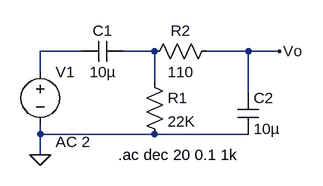
[diagram p0: schematic BPF.asc]
BPF.asc, the LTspice schematic file:
Version 4
SHEET 1 880 680
WIRE 32 96 -32 96
WIRE 144 96 96 96
WIRE 288 96 224 96
WIRE 336 96 288 96
WIRE -32 128 -32 96
WIRE 144 144 144 96
WIRE 288 160 288 96
WIRE -32 224 -32 208
WIRE 144 224 -32 224
WIRE 288 224 144 224
WIRE -32 256 -32 224
FLAG -32 256 0
FLAG 336 96 Vo
SYMBOL cap 96 80 R90
WINDOW 0 0 32 VBottom 2
WINDOW 3 32 32 VTop 2
SYMATTR InstName C1
SYMATTR Value 10µ
SYMBOL res 128 128 R0
SYMATTR InstName R1
SYMATTR Value 22K
SYMBOL res 240 80 R90
WINDOW 0 0 56 VBottom 2
WINDOW 3 32 56 VTop 2
SYMATTR InstName R2
SYMATTR Value 110
SYMBOL cap 272 160 R0
SYMATTR InstName C2
SYMATTR Value 10µ
SYMBOL voltage -32 112 R0
WINDOW 123 24 124 Left 2
WINDOW 39 0 0 Left 0
SYMATTR InstName V1
SYMATTR Value ""
SYMATTR Value2 AC 2
TEXT 88 256 Left 2 !.ac dec 20 0.1 1k

The netlist it stands for:
* BPF.asc
C1 N002 N001 10µ
R1 N002 0 22K
R2 Vo N002 110
C2 Vo 0 10µ
V1 N001 0 AC 2
.ac dec 20 0.1 1k
.backanno
.end